# EAGLE design placa_esp (EAGLE 7.7.0)
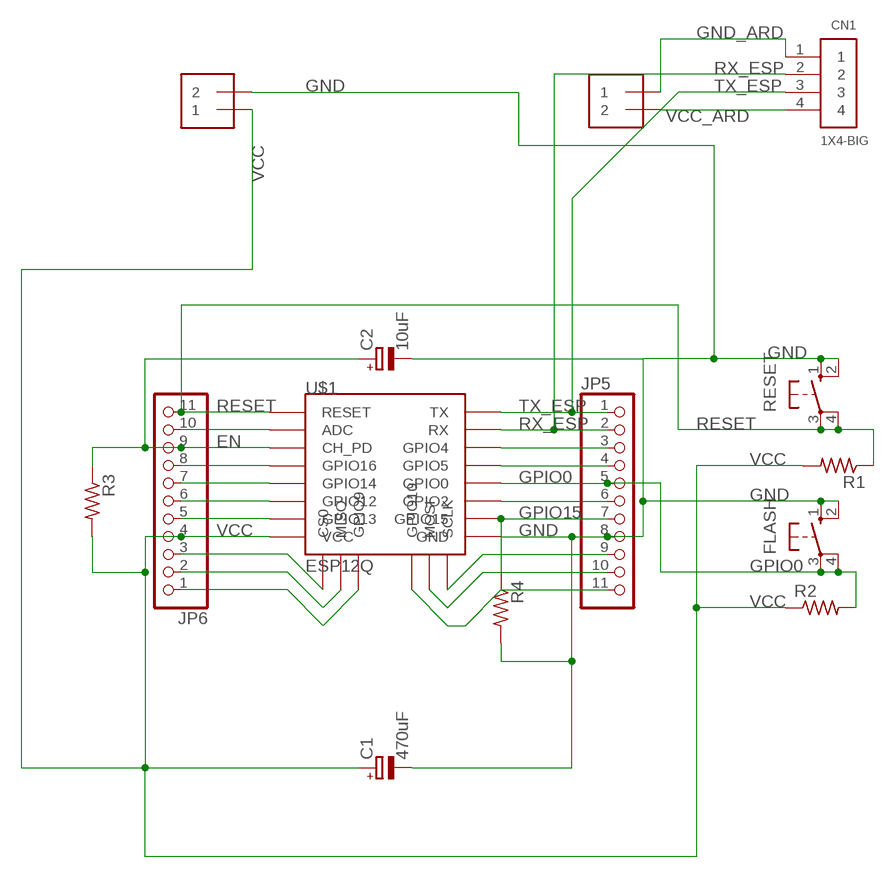
[diagram p0: schematic, sheet 1]

## Parts
C1  470uF  CPOL-EUE5-5  [E5-5]
C2  10uF  CPOL-EUE3.5-8  [E3,5-8]
CN1  1X4-BIG  [1X04-BIG]
FLASH  10-XX  [B3F-10XX]
J1  1X2-3.5MM  [1X2-3.5MM]
J2  1X2-3.5MM  [1X2-3.5MM]
JP5  PINHD-1X11  [1X11]
JP6  PINHD-1X11  [1X11]
R1  R-US_0204/5  [0204/5]
R2  R-US_0204/5  [0204/5]
R3  R-US_0204/5  [0204/5]
R4  R-US_0204/5  [0204/5]
RESET  10-XX  [B3F-10XX]
U$1  ESP12Q  [ESP12Q]

## Nets
EN: C2.+ JP6.9 R3.1 U$1.CH_PD
GND: C1.- C2.- FLASH.1(S) FLASH.2(S1) J2.2 JP5.8 R4.2 RESET.1(S) RESET.2(S1) U$1.GND
GND_ARD: CN1.1 J1.1
GPIO0: FLASH.3(P) FLASH.4(P1) JP5.5 R2.2 U$1.GPIO0
GPIO15: JP5.7 R4.1 U$1.GPIO15
N$1: JP5.9 U$1.SCLK
N$2: JP5.10 U$1.MOSI
N$3: JP5.11 U$1.GPIO10
N$4: JP6.3 U$1.CS0
N$5: JP6.2 U$1.MISO
N$6: JP6.1 U$1.GPIO9
N$7: JP6.10 U$1.ADC
N$8: JP6.8 U$1.GPIO16
N$9: JP6.7 U$1.GPIO14
N$10: JP6.6 U$1.GPIO12
N$11: JP6.5 U$1.GPIO13
N$12: JP5.3 U$1.GPIO4
N$13: JP5.4 U$1.GPIO5
N$14: JP5.6 U$1.GPIO2
RESET: JP6.11 R1.1 RESET.3(P) RESET.4(P1) U$1.RESET
RX_ESP: CN1.2 JP5.2 U$1.RX
TX_ESP: CN1.3 JP5.1 U$1.TX
VCC: C1.+ J2.1 JP6.4 R1.2 R2.1 R3.2 U$1.VCC
VCC_ARD: CN1.4 J1.2

## Library data of the parts
C1 C2 = resistor:CPOL-EU: POLARIZED CAPACITOR, European symbol
CN1 = adafruit:1X4: 4-pin connector
FLASH RESET = switch-omron:10-XX: OMRON SWITCH; MPN: B3F-1000; OC_FARNELL: 176432; OC_NEWARK: 36M3542
J1 J2 = adafruit:1X2: 3.5mm Terminal block http://www.ladyada.net/library/pcb/eaglelibrary.html
JP5 JP6 = pinhead:PINHD-1X11: PIN HEADER
R1-R4 = adafruit:R-US_: RESISTOR, American symbol
U$1 = esp826612q:ESP12Q: ESP8266 Wifi module 12-Q

## Board
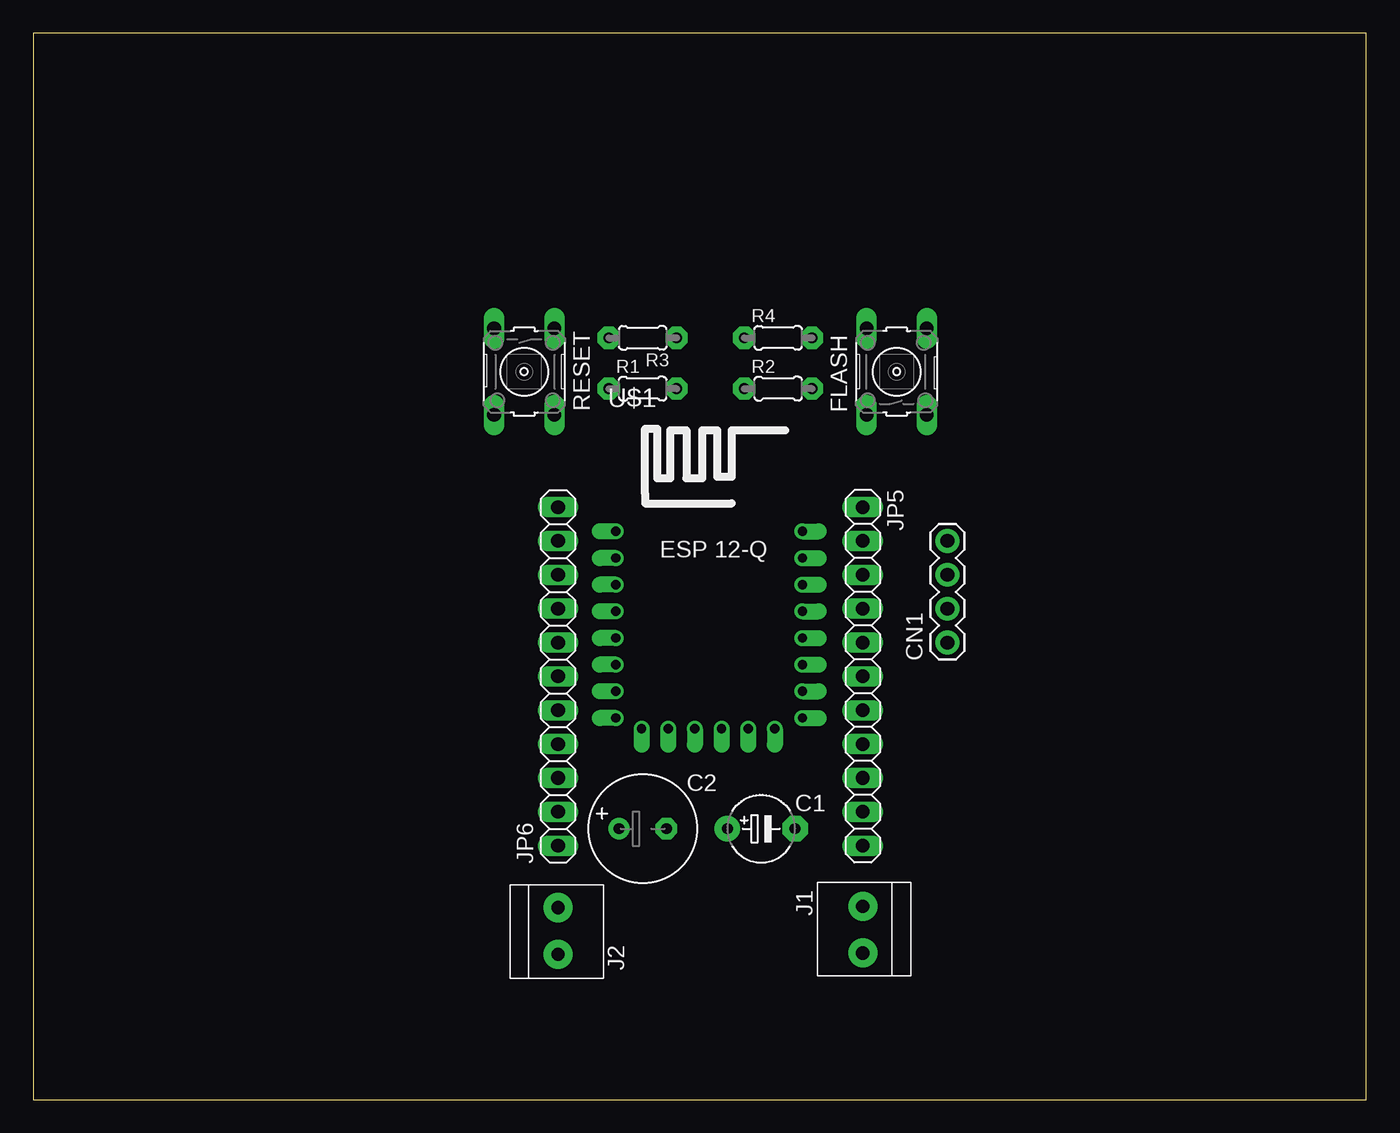
[diagram p1: board, top side]
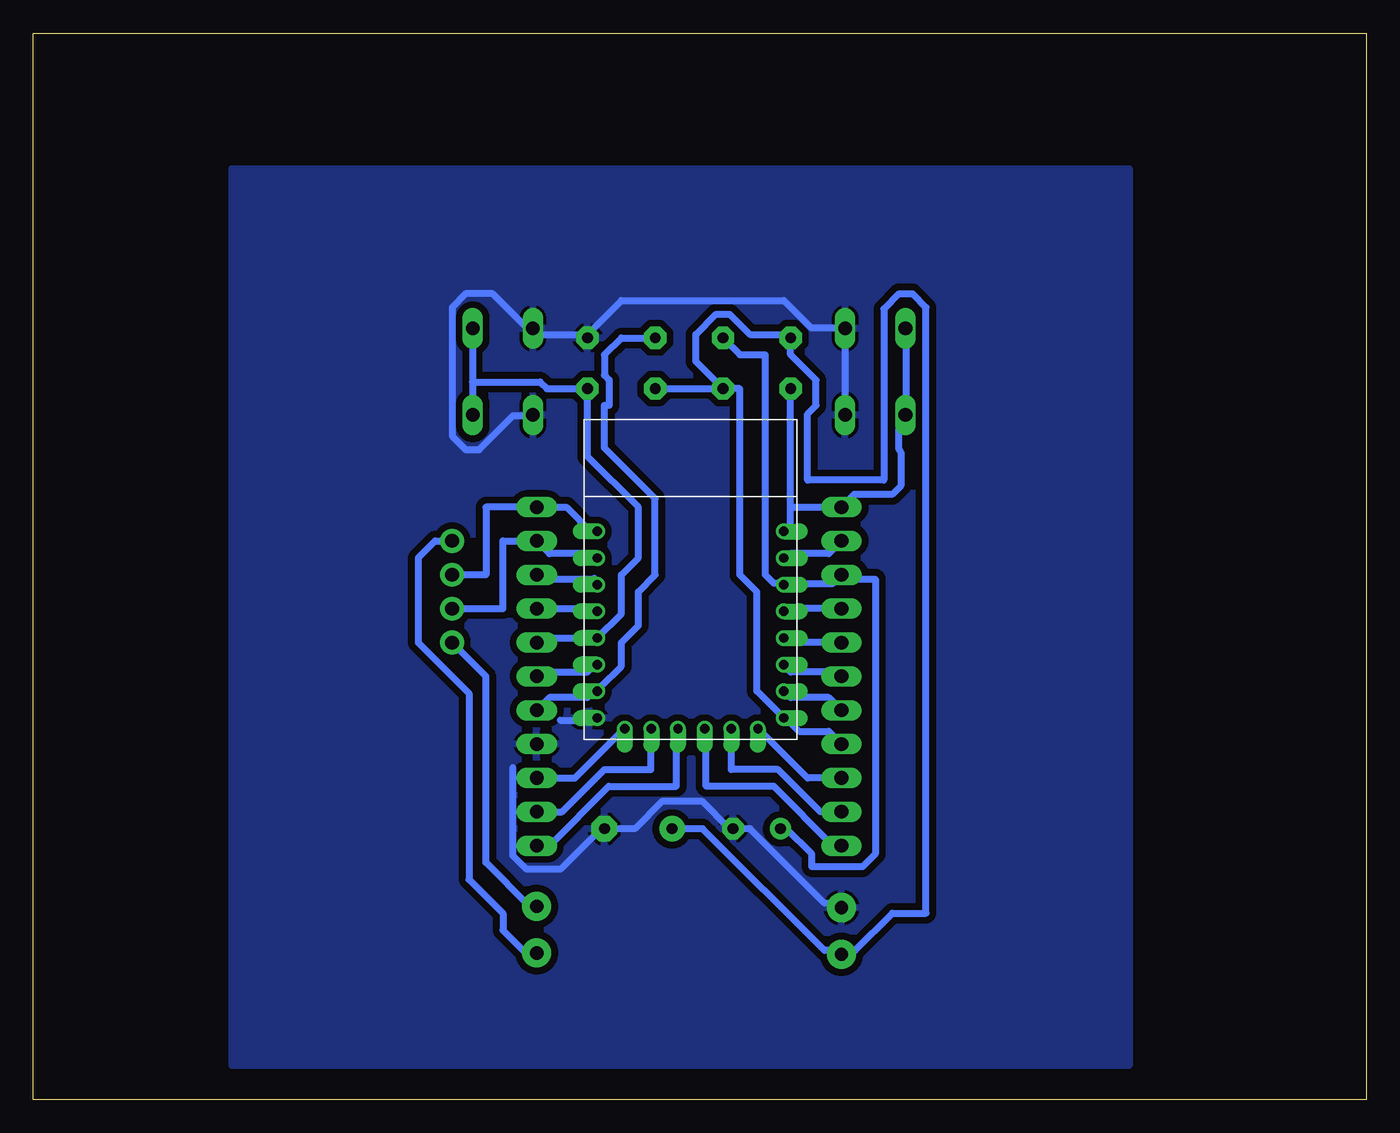
[diagram p2: board, bottom side, seen from below]

Size 100 x 80 mm. Coordinates in mm from the lower left corner, seen from the top.
Outline: 0,0 100,0 100,80 0,80 0,0
Copper layers (1*16): Top 0.035mm / dielectric 1.5mm / Bottom 0.035mm
Design rules "default *": minimum track width 20mil, minimum drill 2mil, track to track 20mil, track to pad 20mil, pad to pad 8mil, via to via 8mil, smd to smd 8mil, copper to edge 40mil, drill to drill 8mil, minimum pad ring 10mil, minimum via ring 8mil, stop-mask expansion 4mil, vias tented up to drill 0mil, thermal gap 10mil

### Footprints (pad centres in the part's own frame; a part is rotated, then mirrored left to right if it is on the bottom)
E5-5 = drill 0.813 pad 1.905: + -2.54,0 | drill 0.813 pad 1.905 octagon: - 2.54,0
E3,5-8 = drill 0.813 pad 1.6: + -1.778,0 | drill 0.813 pad 1.6 octagon: - 1.778,0
1X04-BIG = drill 1.016 pad 1.778: 1 0,0; 2 2.54,0; 3 5.08,0; 4 7.62,0
B3F-10XX = drill 1.016 long: 1 -3.251,2.261; 2 3.251,2.261; 3 -3.251,-2.261; 4 3.251,-2.261
1X2-3.5MM = drill 1 pad 2.184: 1 1.8,0; 2 -1.7,0
1X11 = drill 1.016 long: 1 -12.7,0; 2 -10.16,0; 3 -7.62,0; 4 -5.08,0; 5 -2.54,0; 6 0,0; 7 2.54,0; 8 5.08,0; 9 7.62,0; 10 10.16,0; 11 12.7,0
0204/5 = drill 0.813 pad 1.676 octagon: 1 -2.54,0; 2 2.54,0
ESP12Q = drill 0.7 offset: ADC -7.1,3.8; CH_PD -7.1,1.8; CS0 -5.165,-9.005; GND 6.9,-8.2; GPIO0 6.9,-2.2; GPIO2 6.9,-4.2; GPIO4 6.9,1.8; GPIO5 6.9,-0.2; GPIO9 -1.165,-9.005; GPIO10 0.835,-9.005; GPIO12 -7.1,-4.2; GPIO13 -7.1,-6.2; GPIO14 -7.1,-2.2; GPIO15 6.9,-6.2; GPIO16 -7.1,-0.2; MISO -3.165,-9.005; MOSI 2.835,-9.005; RESET -7.1,5.8; RX 6.9,3.8; SCLK 4.835,-9.005; TX 6.9,5.8; VCC -7.1,-8.2

### Placement (x,y rotation side)
C1  54.61,20.32 0 top
C2  45.72,20.32 0 top
CN1  68.58,34.29 90 top
FLASH  64.77,54.61 90 top
J1  62.23,12.7 90 top
J2  39.37,12.7 270 top
JP5  62.23,31.75 270 top
JP6  39.37,31.75 90 top
R1  45.72,53.34 0 top
R2  55.88,53.34 0 top
R3  45.72,57.15 180 top
R4  55.88,57.15 0 top
RESET  36.83,54.61 270 top
U$1  50.8,36.83 0 top

### Tracks (layer width: path | path; a pad name or v marks a point on that pad's centre or on a via)
EN
  Bottom 0.508: 43.69,20.32 C2.+ 43.5,20.32 41.59,18.41 41.59,17.46 37.78,17.46 36.83,18.41 36.83,39.05 39.37,39.05 JP6.9 40.01,38.73 43.5,38.73 U$1.CH_PD 43.8,38.73 44.45,38.73 45.09,39.37 45.09,55.88 46.99,55.88 R3.1
GND
  Bottom 0.508: RESET.2 39.12,51.82 39.12,57.4 RESET.1 39.12,57.91 41.66,57.91 43.69,59.94 55.88,59.94 58.42,57.4 | FLASH.1 62.99,51.31 64.01,51.31 66.55,48.77 67.56,48.77 68.58,49.78 68.58,59.44 67.56,60.45 65.53,60.45 62.99,57.91 FLASH.2 62.48,57.4 58.42,57.4 | 58.42,57.4 R4.2 | 60.45,28.45 57.91,28.45 U$1.GND | J2.2 39.62,14.73 40.64,14.73 46.23,20.32 C2.- 47.75,20.32 49.78,22.35 52.83,22.35 54.86,20.32 C1.- 57.4,20.32 60.45,17.27 62.99,17.27 64.01,18.29 64.01,24.89
  pour Bottom: 17.78,69.85 17.78,2.54 85.09,2.54 85.09,69.85
GND_ARD
  Bottom 0.508: J1.1 62.76,14.5 66.04,17.78 66.04,31.75 CN1.1
GPIO0
  Bottom 0.508: 67.06,53.85 67.06,57.4 FLASH.4 | 67.06,53.85 67.06,51.82 FLASH.3 | 67.06,53.85 61.98,53.85 61.47,53.34 R2.2 58.42,48.26 54.61,44.45 54.61,40.64 55.88,39.37 55.88,36.45 U$1.GPIO0 57.78,34.61 61.91,34.61 JP5.5
GPIO15
  Bottom 0.508: 57.91,30.48 U$1.GPIO15 | 53.34,56.9 R4.1 55.88,57.15 57.15,55.88 57.15,54.34 56.8,53.99 56.8,52.07 57.15,52.07 57.15,48.9 53.34,45.09 53.34,39.37 54.61,38.1 54.61,35.56 55.88,34.29 55.88,32.51 57.4,30.99 U$1.GPIO15 | JP5.7 61.28,30.16 58.42,30.16 58.1,30.48 U$1.GPIO15
N$1
  Bottom 0.508: JP5.9 59.37,24.13 55.88,27.62 U$1.SCLK
N$2
  Bottom 0.508: JP5.10 60.33,21.59 57.15,24.77 53.66,24.77 53.66,27.62 U$1.MOSI
N$3
  Bottom 0.508: JP5.11 61.28,19.05 56.83,23.5 51.75,23.5 51.75,27.62 U$1.GPIO10
N$4
  Bottom 0.508: JP6.3 41.91,24.13 45.4,27.62 U$1.CS0
N$5
  Bottom 0.508: JP6.2 40.96,21.59 44.13,24.77 47.62,24.77 47.62,27.62 U$1.MISO
N$6
  Bottom 0.508: JP6.1 40.01,19.05 44.45,23.5 49.53,23.5 49.53,27.62 U$1.GPIO9
N$7
  Bottom 0.508: 43.69,40.64 U$1.ADC 43.5,40.64 43.18,40.96 40.32,40.96 JP6.10
N$8
  Bottom 0.508: 43.69,36.58 U$1.GPIO16 43.5,36.83 JP6.8
N$9
  Bottom 0.508: 43.69,34.54 U$1.GPIO14 43.5,34.61 43.18,34.29 JP6.7
N$10
  Bottom 0.508: 43.69,32.51 U$1.GPIO12 43.5,32.38 43.18,32.07 39.69,32.07 JP6.6
N$11
  Bottom 0.508: 43.69,30.48 U$1.GPIO13 43.5,30.48 43.18,30.16 40.32,30.16 JP6.5
N$12
  Bottom 0.508: 57.91,39.12 U$1.GPIO4 58.1,39.05 61.91,39.05 JP5.3
N$13
  Bottom 0.508: 57.91,36.58 U$1.GPIO5 58.1,36.51 58.42,36.83 JP5.4
N$14
  Bottom 0.508: 57.91,32.51 U$1.GPIO2 58.1,32.38 58.42,32.07 61.91,32.07 JP5.6
RESET
  Bottom 0.508: RESET.3 34.54,57.4 34.54,51.82 RESET.4 35.05,51.31 35.05,48.77 34.92,48.58 34.92,46.04 35.56,45.4 38.42,45.4 JP6.11 43.18,44.45 | 43.18,42.67 43.69,42.67 U$1.RESET 43.18,42.67 | 43.18,42.67 43.18,44.45 | 43.18,44.45 R1.1
RX_ESP
  Bottom 0.508: CN1.2 64.77,36.83 64.77,41.91 JP5.2 61.28,40.96 58.03,40.96 U$1.RX
TX_ESP
  Bottom 0.508: 57.91,42.67 U$1.TX 58.1,42.55 60.01,44.45 JP5.1 66.04,44.45 66.04,39.37 CN1.3
VCC
  Bottom 0.508: C1.+ 49.78,20.32 40.64,11.18 39.62,11.18 J2.1 39.12,11.18 38.35,11.18 35.56,13.97 33.02,13.97 33.02,59.44 34.04,60.45 35.05,60.45 36.2,59.31 36.2,46.48 41.91,46.48 41.91,51.44 41.27,52.07 41.27,53.98 43.18,55.88 R3.2 | R1.2 50.29,55.37 50.29,57.4 48.77,58.93 47.75,58.93 46.23,57.4 43.18,57.4 R3.2 | 43.18,56.9 R3.2 | R1.2 46.99,53.34 46.99,39.37 45.72,38.1 45.72,30.65 U$1.VCC 43.5,28.57 42.55,27.62 40.32,27.62 JP6.4 | R2.1 R1.2
VCC_ARD
  Bottom 0.508: J1.2 63.07,11 64.77,12.7 64.77,13.97 67.31,16.51 67.31,30.48 71.12,34.29 71.12,40.64 69.85,41.91 CN1.4